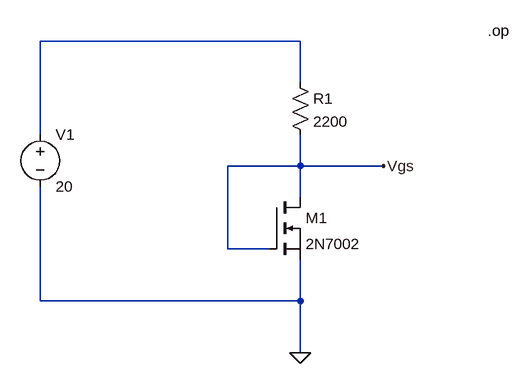
[diagram p0: schematic A01 - Simulacao.asc]
A01 - Simulacao.asc, the LTspice schematic file:
Version 4
SHEET 1 880 680
WIRE 304 -208 -96 -208
WIRE 304 -144 304 -208
WIRE -96 -64 -96 -208
WIRE 304 -16 304 -64
WIRE 304 -16 192 -16
WIRE 432 -16 304 -16
WIRE 304 32 304 -16
WIRE 192 112 192 -16
WIRE 256 112 192 112
WIRE -96 192 -96 16
WIRE 304 192 304 128
WIRE 304 192 -96 192
WIRE 304 272 304 192
FLAG 304 272 0
FLAG 432 -16 Vgs
SYMBOL nmos 256 32 R0
SYMATTR InstName M1
SYMATTR Value 2N7002
SYMBOL res 288 -160 R0
SYMATTR InstName R1
SYMATTR Value 2200
SYMBOL voltage -96 -80 R0
WINDOW 123 0 0 Left 0
WINDOW 39 0 0 Left 0
SYMATTR InstName V1
SYMATTR Value 20
TEXT 592 -224 Left 2 !.op

The netlist it stands for:
* A01 - Simulacao.asc
M1 Vgs Vgs 0 0 2N7002
R1 N001 Vgs 2200
V1 N001 0 20
.model NMOS NMOS
.model PMOS PMOS
.lib standard.mos
.op
.backanno
.end